# Altium schematic sheet cpu.SchDoc
size A3
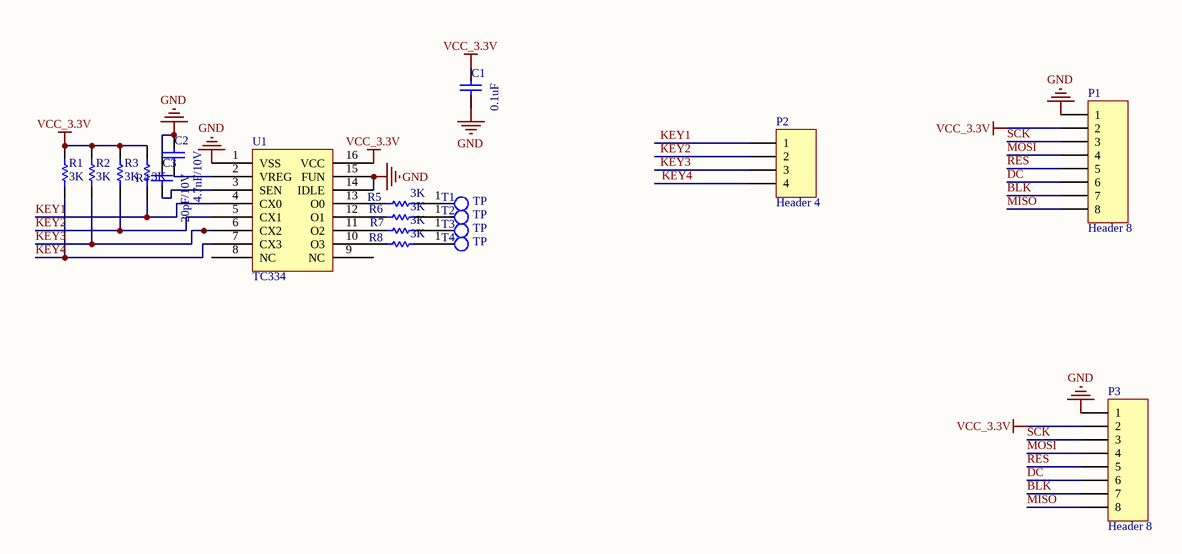
[diagram p0: cpu.SchDoc]

## Parts
C1  0.1uF  [0603C]
C2  4.7nF/10V  [0603C]
C3  20pF/10V  [0603C]
P1  Header 8  [HDR1X8]
P2  Header 4  [HDR1X4]
P3  Header 8  [TFT2.4]
R1  3K  [0603R]
R2  3K  [0603R]
R3  3K  [0603R]
R4  3K  [0603R]
R5  3K  [0603R]
R6  3K  [0603R]
R7  3K  [0603R]
R8  3K  [0603R]
T1  TP  [TOUCH-PAD]
T2  TP  [TOUCH-PAD]
T3  TP  [TOUCH-PAD]
T4  TP  [TOUCH-PAD]
U1  TC334  [SOIC127P600X265-16N]

## Nets
GND: C1.2 C2.1 C3.1 P1.1 P3.1 U1.1(VSS) U1.14(IDLE) U1.15(FUN)
VCC_3.3V: C1.1 P1.2 P3.2 R1.1 R2.1 R3.1 R4.1 U1.16(VCC)
BLK: P1.7 P3.7
DC: P1.6 P3.6
KEY1: P2.1 R4.2 U1.4(CX0)
KEY2: P2.2 R3.2 U1.5(CX1)
KEY3: P2.3 R2.2 U1.6(CX2)
KEY4: P2.4 R1.2 U1.7(CX3)
MISO: P1.8 P3.8
MOSI: P1.4 P3.4
RES: P1.5 P3.5
SCK: P1.3 P3.3
NetC2_2: C2.2 U1.2(VREG)
NetC3_2: C3.2 U1.3(SEN)
NetR5_1: R5.1 T1.1
NetR5_2: R5.2 U1.13(O0)
NetR6_1: R6.1 T2.1
NetR6_2: R6.2 U1.12(O1)
NetR7_1: R7.1 T3.1
NetR7_2: R7.2 U1.11(O2)
NetR8_1: R8.1 T4.1
NetR8_2: R8.2 U1.10(O3)

Not connected (* = marked no-connect by the designer): U1 8(NC) 9(NC)

## Library data of the parts
C1-C3 = Cap: Capacitor; Value: 104; Published: 8-Jun-2000; LatestRevisionDate: 17-Jul-2002; LatestRevisionNote: Re-released for DXP Platform.; PackageReference: RAD-0.3; Publisher: Altium Limited
P1 P3 = Header 8: Header, 8-Pin; LatestRevisionDate: 17-Jul-2002; LatestRevisionNote: Re-released for DXP Platform.; Publisher: Altium Limited
P2 = Header 4: Header, 4-Pin; LatestRevisionDate: 17-Jul-2002; LatestRevisionNote: Re-released for DXP Platform.; Publisher: Altium Limited
R1-R8 = Res Semi: Semiconductor Resistor; Value: 1K; Published: 8-Jun-2000; LatestRevisionDate: 17-Jul-2002; LatestRevisionNote: Re-released for DXP Platform.; PackageReference: AXIAL-0.5; Publisher: Altium Limited